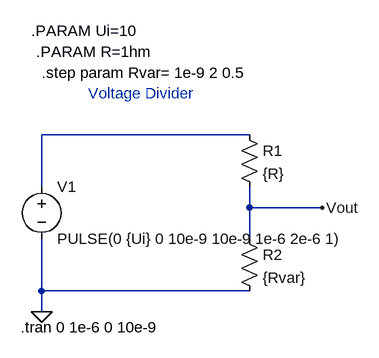
[diagram p0: schematic voltage_divider.asc]
voltage_divider.asc, the LTspice schematic file:
Version 4
SHEET 1 1080 680
WIRE 288 48 -32 48
WIRE -32 128 -32 48
WIRE 288 160 288 128
WIRE 400 160 288 160
WIRE 288 208 288 160
WIRE -32 288 -32 208
WIRE 288 288 -32 288
WIRE -32 320 -32 288
FLAG -32 320 0
FLAG 400 160 Vout
SYMBOL res 272 32 R0
SYMATTR InstName R1
SYMATTR Value {R}
SYMBOL res 272 192 R0
SYMATTR InstName R2
SYMATTR Value {Rvar}
SYMBOL voltage -32 112 R0
WINDOW 123 0 0 Left 0
WINDOW 39 0 0 Left 0
SYMATTR InstName V1
SYMATTR Value PULSE(0 {Ui} 0 10e-9 10e-9 1e-6 2e-6 1)
TEXT -64 344 Left 2 !.tran 0 1e-6 0 10e-9
TEXT 40 -16 Left 2 ;Voltage Divider
TEXT -48 -112 Left 2 !.PARAM Ui=10
TEXT -40 -80 Left 2 !.PARAM R=1hm
TEXT -32 -48 Left 2 !.step param Rvar= 1e-9 2 0.5

The netlist it stands for:
* voltage_divider.asc
R1 N001 Vout {R}
R2 Vout 0 {Rvar}
V1 N001 0 PULSE(0 {Ui} 0 10e-9 10e-9 1e-6 2e-6 1)
.tran 0 1e-6 0 10e-9
* Voltage Divider
.PARAM Ui=10
.PARAM R=1hm
.step param Rvar= 1e-9 2 0.5
.backanno
.end

* Results of the author's LTspice run, read from the files saved beside the schematic
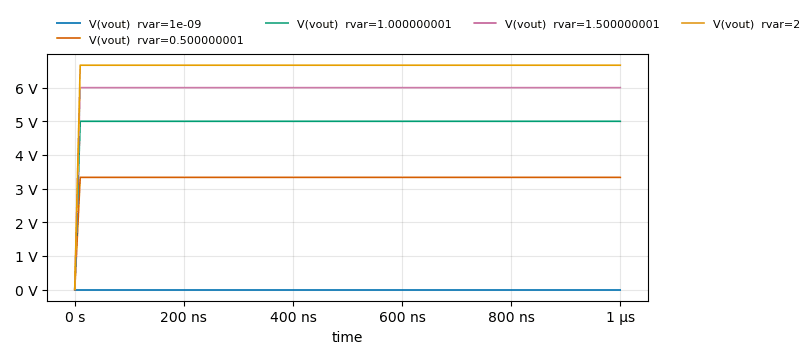
[diagram p1: Transient Analysis of voltage_divider.asc, plotted from the saved traces]
* Transient Analysis, 5 runs:
*   V(vout) [rvar=1e-09]: min 0 V, max 10 nV, average 9.95 nV, rms 9.975 nV, last 10 nV
*   V(vout) [rvar=0.500000001]: min 0 V, max 3.333 V, average 3.317 V, rms 3.325 V, last 3.333 V
*   V(vout) [rvar=1.000000001]: min 0 V, max 5 V, average 4.975 V, rms 4.987 V, last 5 V
*   V(vout) [rvar=1.500000001]: min 0 V, max 6 V, average 5.97 V, rms 5.985 V, last 6 V
*   V(vout) [rvar=2]: min 0 V, max 6.667 V, average 6.633 V, rms 6.65 V, last 6.667 V